# Altium schematic sheet CTRL_POWER_OVER_ETHERNET.SchDoc: Power Over Ethernet Controller
size A4; Organization: Altium Limited.; Address1: Level 3, 12a Rodborough Rd; Address2: Frenchs Forest 2086; Address3: NSW; Address4: AUSTRALIA; SheetNumber: 1; SheetTotal: 100
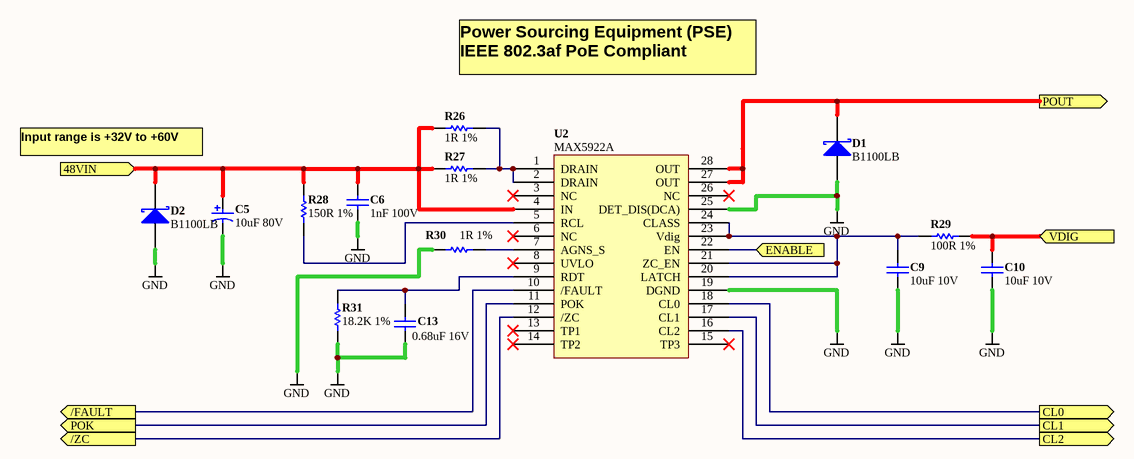
[diagram p0: CTRL_POWER_OVER_ETHERNET.SchDoc]

## Parts
C5  10uF 80V  [CAP_FK_E_ELECTRO]
C6  1nF 100V  [CAPC2012-STAR]
C9  10uF 10V  [CAPC2012-STAR]
C10  10uF 10V  [CAPC2012-STAR]
C13  0.68uF 16V  [CAPC1608-STAR]
D1  B1100LB  [DIOM8059]
D2  B1100LB  [DIOM8059]
R26  1R 1%  [RESC2012-STAR]
R27  1R 1%  [RESC2012-STAR]
R28  150R 1%  [RESC1005-STAR]
R29  100R 1%  [RESC1005-STAR]
R30  1R 1%  [RESC2012-STAR]
R31  18.2K 1%  [RESC1005-STAR]
U2  MAX5922A  [TSOP65P640-28]

## Ports
48VIN (in), /FAULT (out), /ZC (out), CL0 (out), CL1 (out), CL2 (out), ENABLE (in), POK (out), POUT (out), VDIG (in)

## Nets
GND: C5.2 C6.2 C9.2 C10.2 C13.2 D1.1(A) D2.1(A) R30.2 R31.2 U2.19(DGND) U2.25(DET_DIS(DCA))
48VIN: C5.1 C6.1 D2.2(K) R26.1 R27.1 R28.1 U2.4(IN) ; port 48VIN
/FAULT: U2.10(/FAULT) ; port /FAULT
/ZC: U2.12(/ZC) ; port /ZC
CL0: U2.18(CL0) ; port CL0
CL1: U2.17(CL1) ; port CL1
CL2: U2.16(CL2) ; port CL2
ENABLE: U2.22(EN) ; port ENABLE
POK: U2.11(POK) ; port POK
POUT: D1.2(K) U2.27(OUT) U2.28(OUT) ; port POUT
VDIG: C10.1 R29.2 ; port VDIG
NetC9_1: C9.1 R29.1 U2.20(LATCH) U2.21(ZC_EN) U2.23(Vdig) U2.24(CLASS)
NetC13_1: C13.1 R31.1 U2.9(RDT)
NetR26_2: R26.2 R27.2 U2.1(DRAIN) U2.2(DRAIN)
NetR28_2: R28.2 U2.5(RCL)
NetR30_1: R30.1 U2.7(AGNS_S)

Not connected (* = marked no-connect by the designer): U2 3(NC)* 6(NC)* 8(UVLO)* 13(TP1)* 14(TP2)* 15(TP3)* 26(NC)*

## Notes on the sheet
- Power Sourcing Equipment (PSE)
  IEEE 802.3af PoE Compliant
- Input range is +32V to +60V
- Sheet Title
- Project Title
- Size:
- Date:
- A4
- Assy:
- Time:
- Revision:
- Sheet
- of
- File:

## Library data of the parts
C5 = D-101-0113: Capacitor, Electro, SMD, 80V, 10uF, Case E; Polarity: Polarized; Tolerance: 20 %; Capacitance: 10 uF; Mounting Technology: Surface Mount; Rated Voltage: 80 V; Status: Production; Technology: Electrolytic; Category: Capacitor
C6 = D-101-0115: Capacitor, Ceramic, 1nF, 100V, 0805, X7R; Capacitance: 1000 pF; Polarity: Polarized; Tolerance: %; Mounting Technology: Surface Mount; Rated Voltage: 100 V; Status: Production; Technology: Ceramic; Category: Capacitor
C9 C10 = D-101-0087: Capacitor, Ceramic, 10uF 10% 10V 0805 (2012) X5R; Polarity: Non-Polarized; Capacitance: 10 uF; Dielectric: X5R; Mounting Technology: Surface Mount; Rated Voltage: 10 V; Status: Unreleased; Technology: None; Tolerance: 10 %; Category: Capacitor
C13 = D-101-0114: Capacitor, Ceramic, 0.68uF 20% 16V 0603 X5R; Polarity: Non-Polarized; Capacitance: 0.68 uF; Dielectric: X5R; Mounting Technology: Surface Mount; Rated Voltage: 16 V; Status: Production; Technology: Ceramic; Tolerance: 20 %; Category: Capacitor
D1 D2 = D-151-0005: Schottky Diode, 1A, 100V, SMB, B1100LB; Max Forward Current: 1 A; Mounting Technology: Surface Mount; Rated Voltage: 100 V; Status: Production; Category: Diode-Schottky
R26 R27 R30 = D-100-0048: Resistor, 1R 1% 0805 (2012); Power Rating: 125 mW; Mounting Technology: Surface Mount; Resistance: 1 R; Status: Production; Tolerance: 1 %; Category: Resistor
R28 = D-100-0005: Resistor, 150R 1% 0402 (1005); Power Rating: 63 mW; Mounting Technology: Surface Mount; Resistance: 150 R; Status: Unreleased; Tolerance: 1 %; Category: Resistor
R29 = D-100-0131: Resistor, 100R 1% 0402 (1005); Power Rating: 63 mW; Mounting Technology: Surface Mount; Resistance: 100 R; Status: Production; Tolerance: 1 %; Category: Resistor
R31 = D-100-0150: Resistor, 18.2K 1% 0402 (1005); Power Rating: 63 mW; Mounting Technology: Surface Mount; Resistance: 18.2 K; Status: Production; Tolerance: 1 %; Category: Resistor
U2 = D-204-0019: MAX5922A, PoE Controller; Max Input Voltage: mV; Max Output Current: mA; Max Output Voltage: mV; Min Input Voltage: mV; Min Output Voltage: mV; Mounting Technology: Surface Mount; Status: Production; Supply Voltage: mV; Category: IC-Power